# Altium schematic sheet Roseta_Shield.SchDoc
size A4
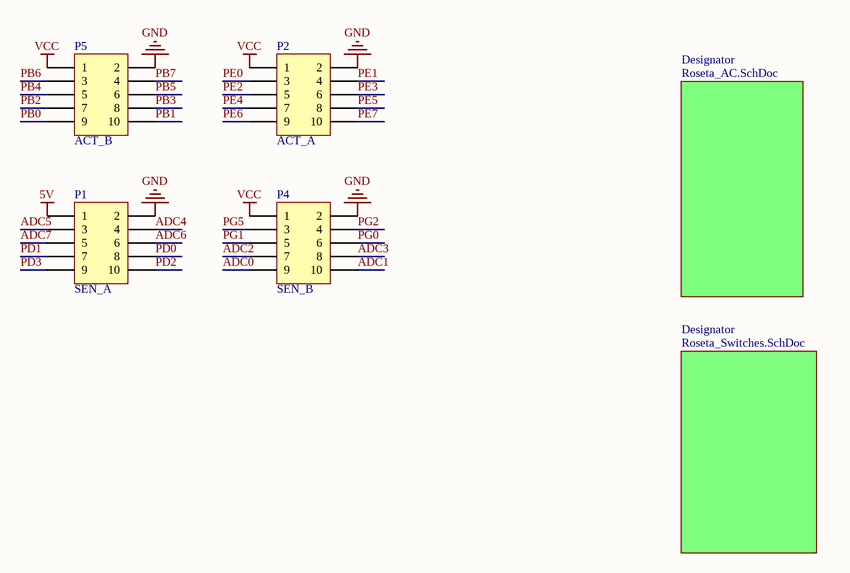
[diagram p0: Roseta_Shield.SchDoc]

## Parts
P1  SEN_A  [HDR2X5_Female_Slim]
P2  ACT_A  [HDR2X5_Female_Slim]
P4  SEN_B  [HDR2X5_Female_Slim]
P5  ACT_B  [HDR2X5_Female_Slim]

## Sub-sheets
Designator = Roseta_AC.SchDoc: no entries
Designator = Roseta_Switches.SchDoc: no entries

## Nets
5V: P1.1
GND: P1.2 P2.2 P4.2 P5.2
VCC: P2.1 P4.1 P5.1
ADC0: P4.9
ADC1: P4.10
ADC2: P4.7
ADC3: P4.8
ADC4: P1.4
ADC5: P1.3
ADC6: P1.6
ADC7: P1.5
PB0: P5.9
PB1: P5.10
PB2: P5.7
PB3: P5.8
PB4: P5.5
PB5: P5.6
PB6: P5.3
PB7: P5.4
PD0: P1.8
PD1: P1.7
PD2: P1.10
PD3: P1.9
PE0: P2.3
PE1: P2.4
PE2: P2.5
PE3: P2.6
PE4: P2.7
PE5: P2.8
PE6: P2.9
PE7: P2.10
PG0: P4.6
PG1: P4.5
PG2: P4.4
PG5: P4.3

## Library data of the parts
P1 P2 P4 P5 = Header 5X2: Header, 5-Pin, Dual row; LatestRevisionDate: 17-Jul-2002; LatestRevisionNote: Re-released for DXP Platform.; Publisher: Altium Limited